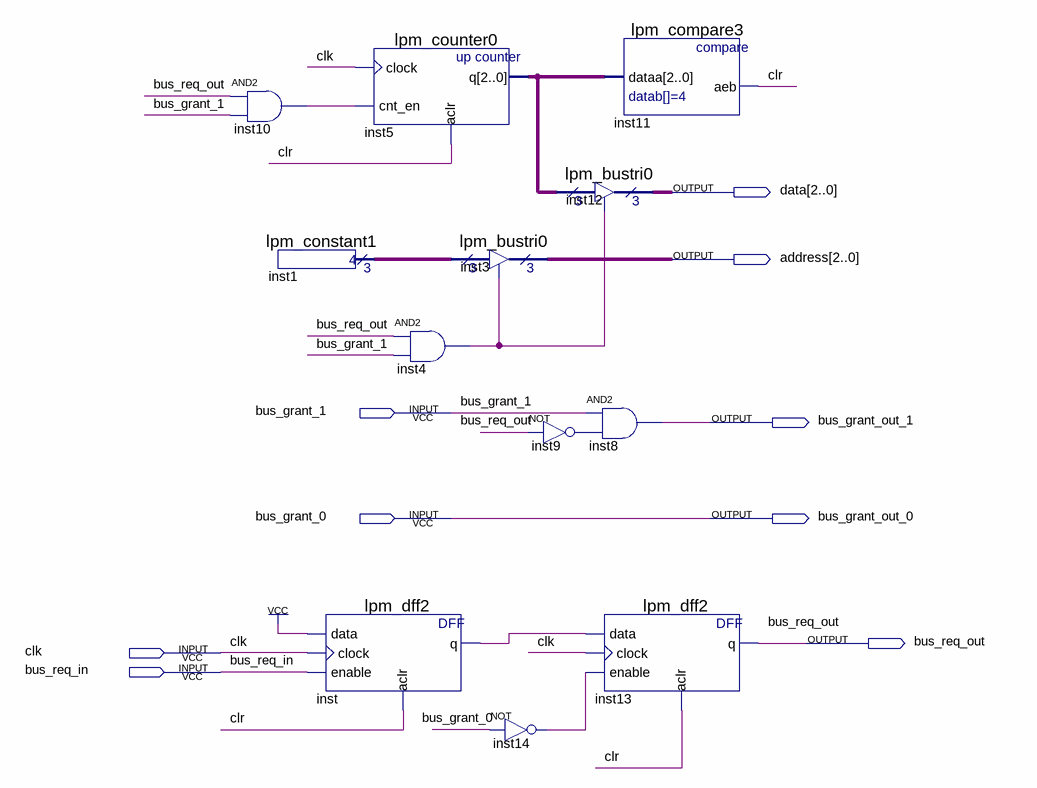
[diagram p0: schematic sheet]
// Quartus schematic Master_0_1.bdf as structural Verilog: 12 symbols, 9 pins
module Master_0_1 (
  input  bus_grant_1,
  input  bus_grant_0,
  input  clk,
  input  bus_req_in,
  output [2:0] data,
  output [2:0] address,
  output bus_grant_out_1,
  output bus_grant_out_0,
  output bus_req_out
);

  wire clr, inst4_out, inst9_out, inst10_out, inst14_out, inst_q;
  wire [2:0] inst1_result, inst5_q;

  and inst10 (inst10_out, bus_req_out, bus_grant_1);
  lpm_constant1 inst1 (.result(inst1_result));
  lpm_dff2 inst (.data(1'b1), .clock(clk), .enable(bus_req_in), .aclr(clr), .q(inst_q));
  lpm_counter0 inst5 (.clock(clk), .cnt_en(inst10_out), .aclr(clr), .q(inst5_q));
  and inst4 (inst4_out, bus_req_out, bus_grant_1);
  lpm_bustri0 inst3 (.enabledt(inst4_out), .data(inst1_result), .tridata(address));
  not inst14 (inst14_out, bus_grant_0);
  lpm_bustri0 inst12 (.enabledt(inst4_out), .data(inst5_q), .tridata(data));
  not inst9 (inst9_out, bus_req_out);
  lpm_compare3 inst11 (.dataa(inst5_q), .aeb(clr));
  and inst8 (bus_grant_out_1, bus_grant_1, inst9_out);
  lpm_dff2 inst13 (.data(inst_q), .clock(clk), .enable(inst14_out), .aclr(clr), .q(bus_req_out));

  assign bus_grant_out_0 = bus_grant_0;
endmodule
